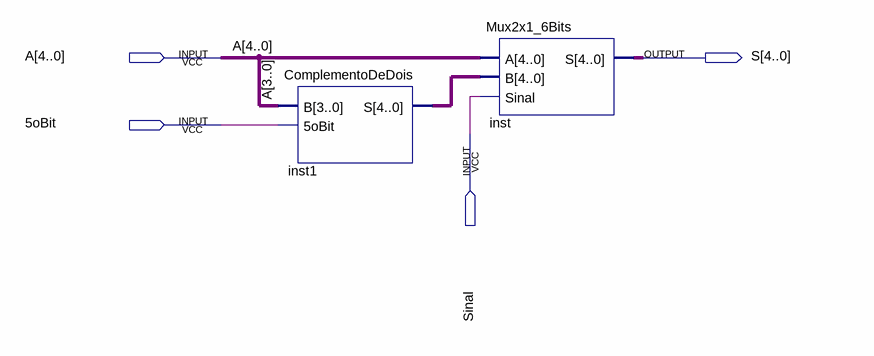
[diagram p0: schematic sheet]
// Quartus schematic NegNum.bdf as structural Verilog: 2 symbols, 4 pins
module NegNum (
  input  [4:0] A,
  input  \5oBit ,
  input  Sinal,
  output [4:0] S
);

  wire [4:0] inst1_s;

  ComplementoDeDois inst1 (.B(A[3:0]), .\5oBit (\5oBit ), .S(inst1_s));
  Mux2x1_6Bits inst (.A(A), .B(inst1_s), .Sinal(Sinal), .S(S));
endmodule
